# Altium schematic sheet EDU_High-Speed-Design_CPU_Audio.SchDoc: CPU Audio
size 279 x 215 mm; Date: not used; ApprovedBy: not used; CheckedBy: not used; Author: not used; DrawnBy: not used; Organization: not used; Address4: not used; SheetNumber: 25; SheetTotal: 27; Time: not used; ImagePath: not used; Application_BuildNumber: not used
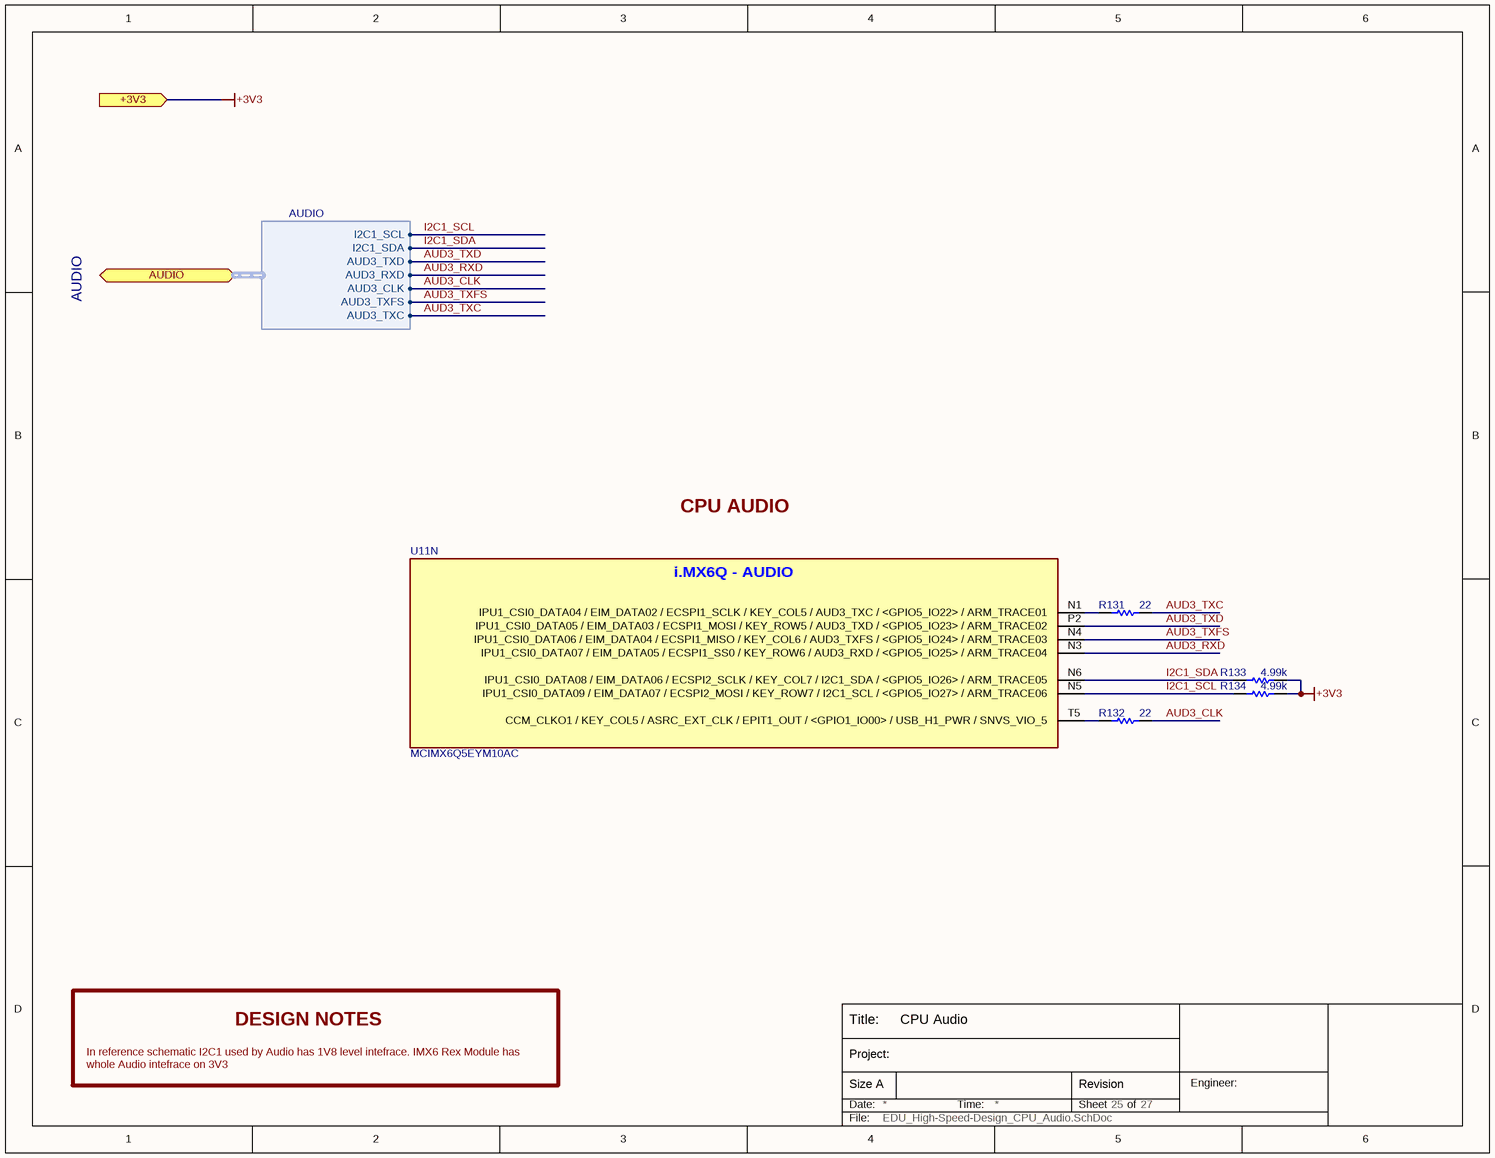
[diagram p0: EDU_High-Speed-Design_CPU_Audio.SchDoc]

## Parts
R131  22  [R0402]
R132  22  [R0402]
R133  4.99k  [R0402]
R134  4.99k  [R0402]
U11  MCIMX6Q5EYM10AC  [MCIMX6Q5EYM10AC]  (part N of 15)

## Ports
+3V3 (in), AUDIO (bidir, harness AUDIO)

## Harnesses
AUDIO: I2C1_SCL, AUD3_TXD, AUD3_RXD, I2C1_SDA, AUD3_CLK, AUD3_TXFS, AUD3_TXC

## Nets
+3V3: R133.2 R134.2 ; port +3V3
AUD3_CLK: R132.1 ; port AUDIO.AUD3_CLK
AUD3_RXD: U11.N3(IPU1_CSI0_DATA07_/_EIM_DATA05_/_ECSPI1_SS0_/_KEY_ROW6_/_AUD3_RXD_/_<GPIO5_IO25>_/_ARM_TRACE04) ; port AUDIO.AUD3_RXD
AUD3_TXC: R131.1 ; port AUDIO.AUD3_TXC
AUD3_TXD: U11.P2(IPU1_CSI0_DATA05_/_EIM_DATA03_/_ECSPI1_MOSI_/_KEY_ROW5_/_AUD3_TXD_/_<GPIO5_IO23>_/_ARM_TRACE02) ; port AUDIO.AUD3_TXD
AUD3_TXFS: U11.N4(IPU1_CSI0_DATA06_/_EIM_DATA04_/_ECSPI1_MISO_/_KEY_COL6_/_AUD3_TXFS_/_<GPIO5_IO24>_/_ARM_TRACE03) ; port AUDIO.AUD3_TXFS
I2C1_SCL: R134.1 U11.N5(IPU1_CSI0_DATA09_/_EIM_DATA07_/_ECSPI2_MOSI_/_KEY_ROW7_/_I2C1_SCL_/_<GPIO5_IO27>_/_ARM_TRACE06) ; port AUDIO.I2C1_SCL
I2C1_SDA: R133.1 U11.N6(IPU1_CSI0_DATA08_/_EIM_DATA06_/_ECSPI2_SCLK_/_KEY_COL7_/_I2C1_SDA_/_<GPIO5_IO26>_/_ARM_TRACE05) ; port AUDIO.I2C1_SDA
NetR131_2: R131.2 U11.N1(IPU1_CSI0_DATA04_/_EIM_DATA02_/_ECSPI1_SCLK_/_KEY_COL5_/_AUD3_TXC_/_<GPIO5_IO22>_/_ARM_TRACE01)
NetR132_2: R132.2 U11.T5(CCM_CLKO1_/_KEY_COL5_/_ASRC_EXT_CLK_/_EPIT1_OUT_/_<GPIO1_IO00>_/_USB_H1_PWR_/_SNVS_VIO_5)

## Notes on the sheet
- AUDIO
- CPU AUDIO
- DESIGN NOTES
- In reference schematic I2C1 used by Audio has 1V8 level intefrace. IMX6 Rex Module has whole Audio intefrace on 3V3
- Title:
- Date:
- Size A
- Project:
- Time:
- Sheet
- Revision
- of
- Engineer:
- File:
- (in symbol MCIMX6Q5EYM10AC, part N) i.MX6Q - AUDIO

## Library data of the parts
R131 R132 = RC0402FR-0722RL: RES 22.0 OHM 1/16W 1% 0402 SMD; Manufacturer 1: Yageo; Manufacturer Part Number 1: RC0402FR-0722RL; Resistance: 22; Supplier 1: Digi-Key; Supplier Part Number 1: 311-22.0LRCT-ND; ComponentLink1URL: http://www.yageo.com/documents/recent/PYu-RC0402_51_RoHS_L_6.pdf; ComponentLink1Description: http://www.yageo.com/documents/recent/PYu-RC0402_51_RoHS_L_6.pdf
R133 R134 = RMCF0402FT4K99: RES TF 4.99K OHM 1% 1/16W 0402; Manufacturer 1: Stackpole Electronics Inc; Manufacturer Part Number 1: RMCF0402FT4K99; Resistance: 4.99k; Supplier 1: Digi-Key; Supplier Part Number 1: RMCF0402FT4K99CT-ND; ComponentLink1URL: http://www.seielect.com/Catalog/SEI-RMCF.pdf; ComponentLink1Description: http://www.seielect.com/Catalog/SEI-RMCF.pdf
U11 = MCIMX6Q5EYM10AC: IC MCU 32BIT ARM QUAD 624FCBGA; Manufacturer 1: Freescale Semiconductor; Supplier 1: Digi-Key; Manufacturer Part Number 1: MCIMX6Q5EYM10AC; Supplier Part Number 1: MCIMX6Q5EYM10AC-ND